# EAGLE design ParaBeep V0.2 (EAGLE 9.5.2)
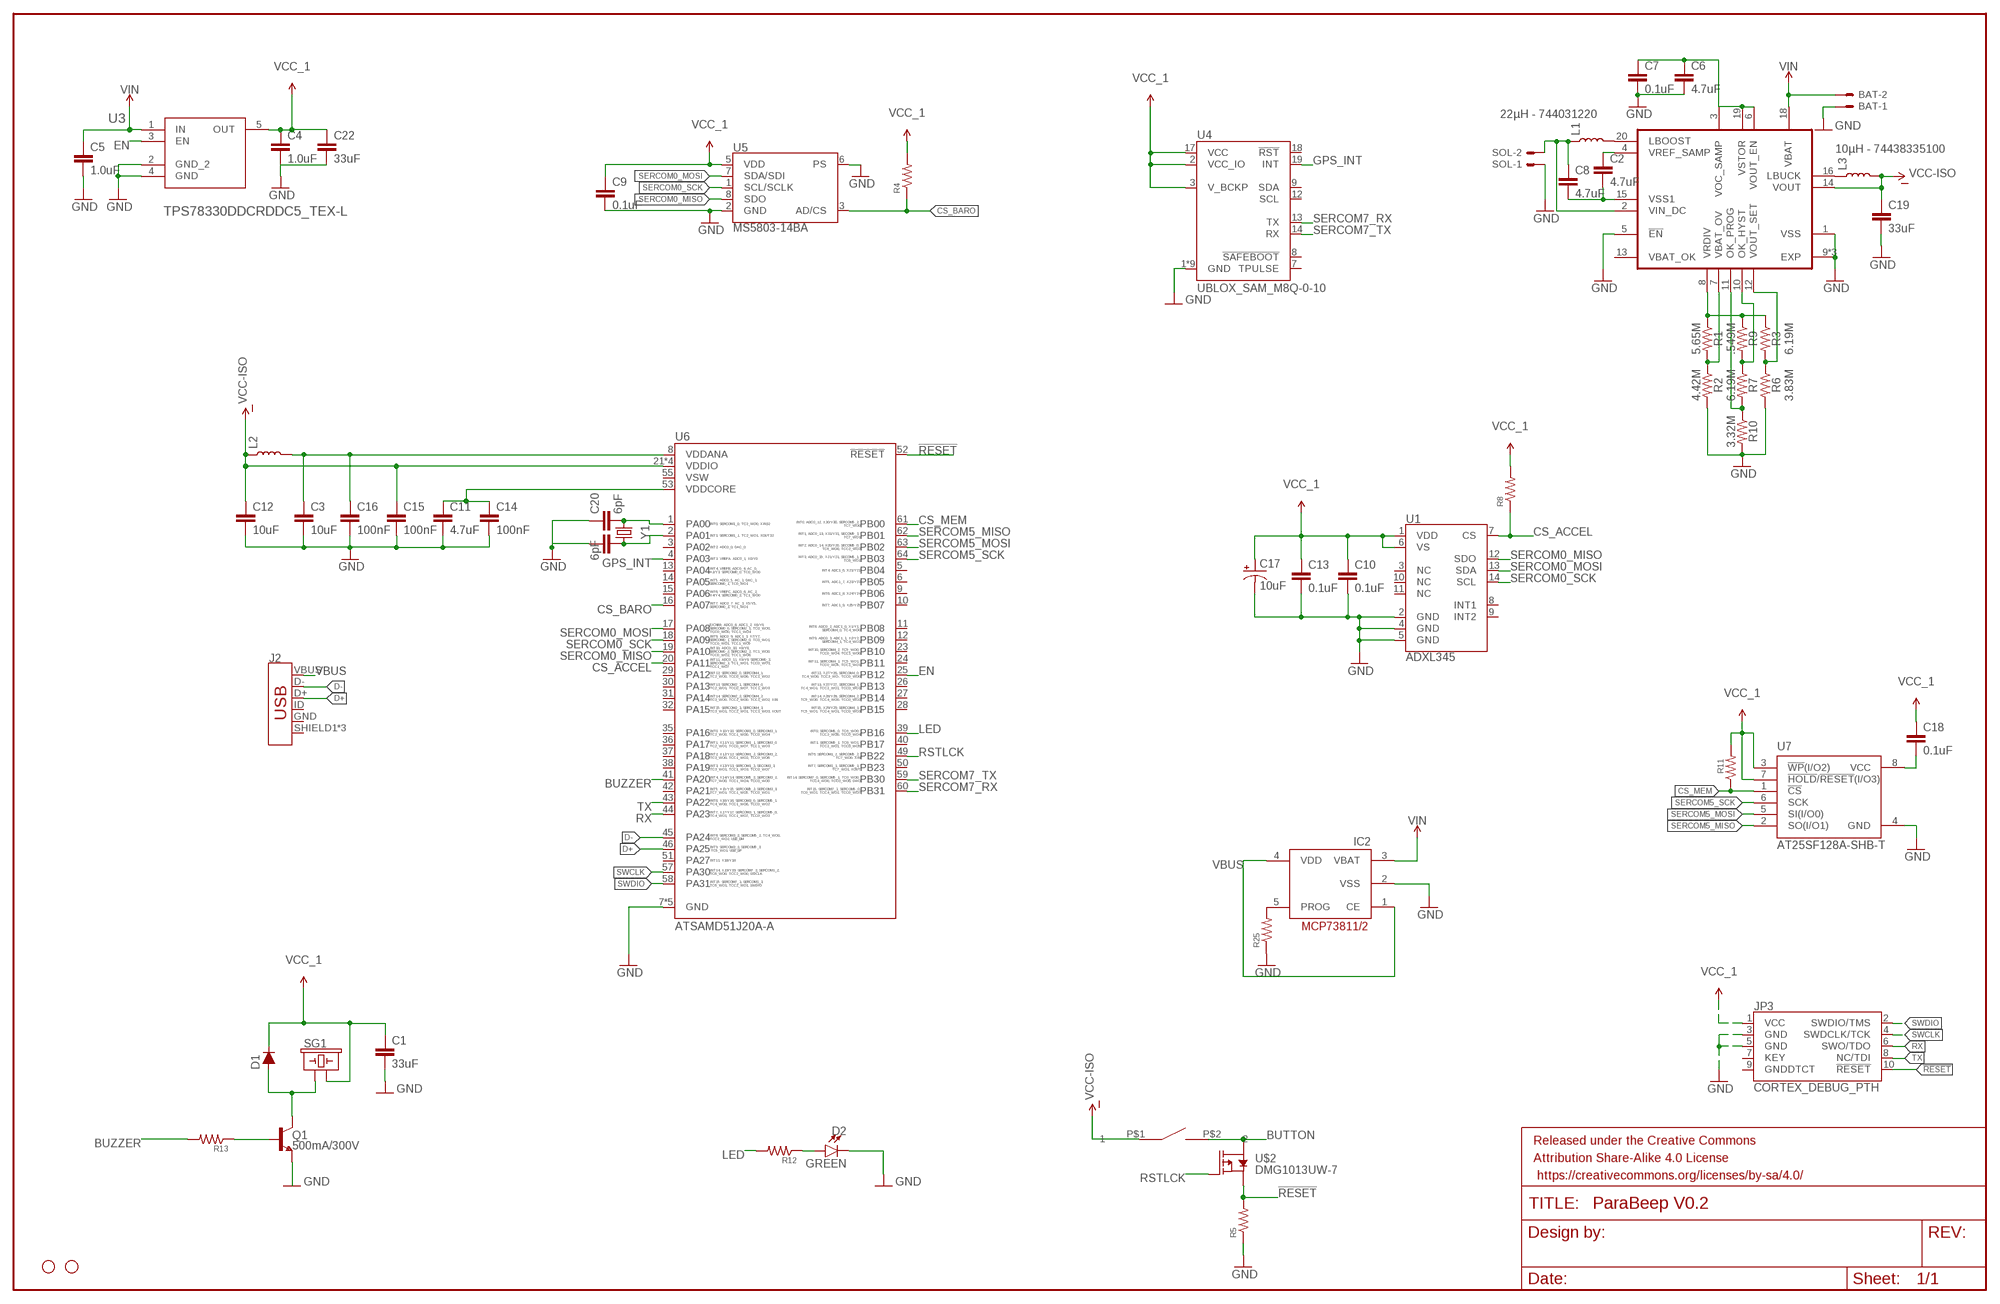
[diagram p0: schematic, sheet 1]

## Parts
BAT  SM02B-SSR-H-TB  [SM02B-SSR-H-TB]
C1  33uF  CAP-1206  [1206]
C2  4.7uF  4.7UF-0603-6.3V-(10%)  [0603]
C3  10uF  1.0UF-0603-16V-10%  [0603]
C4  1.0uF  1.0UF-0603-16V-10%  [0603]
C5  1.0uF  1.0UF-0603-16V-10%  [0603]
C6  4.7uF  4.7UF-0603-6.3V-(10%)  [0603]
C7  0.1uF  0.1UF-0603-25V-5%  [0603]
C8  4.7uF  4.7UF-0603-6.3V-(10%)  [0603]
C9  0.1uF  0.1UF-0603-25V-(+80/-20%)  [0603]
C10  0.1uF  0.1UF-0603-25V-(+80/-20%)  [0603]
C11  4.7uF  0.1UF-0603-25V-(+80/-20%)  [0603]
C12  10uF  0.1UF-0603-25V-(+80/-20%)  [0603]
C13  0.1uF  0.1UF-0603-25V-(+80/-20%)  [0603]
C14  100nF  0.1UF-0603-25V-(+80/-20%)  [0603]
C15  100nF  0.1UF-0603-25V-(+80/-20%)  [0603]
C16  100nF  0.1UF-0603-25V-(+80/-20%)  [0603]
C17  10uF  10UF-POLAR-0603-6.3V-20%(TANT)  [0603-POLAR]
C18  0.1uF  0.1UF-0603-25V-(+80/-20%)  [0603]
C19  33uF  CAP-1206  [1206]
C20  6pF  6PF-0402-50V-0.5%  [0402]
C21  6pF  6PF-0402-50V-0.5%  [0402]
C22  33uF  CAP-1206  [1206]
D1  250mA/100V  DIODE-BAS16J  [SOD-323]
D2  GREEN  LED-GREEN0603  [LED-0603]
FRAME1  FRAME-LEDGER  [CREATIVE_COMMONS]
H1  STAND-OFFTIGHT  [STAND-OFF-TIGHT]
H2  STAND-OFFTIGHT  [STAND-OFF-TIGHT]
IC2  MCP73811/2  [SOT23-5L]
J2  USB_MICRO-B_FEMALE-SMT  [USB-B-MICRO-SMD]
JP3  CORTEX_DEBUG_PTH  [2X5-PTH-1.27MM]
L1  22µH - 744031220  INDUCTOR-CDRH-4.7UH  [INDUCTOR_4.7UH]
L2  INDUCTORFB-30OHM  [0603]
L3  10µH - 74438335100  INDUCTOR-CDRH-4.7UH  [INDUCTOR_4.7UH]
Q1  500mA/300V  TRANS_NPN-MMBTA42  [SOT23-3]
R1  5.65M  RESISTOR0603  [0603]
R2  4.42M  RESISTOR0603  [0603]
R3  6.19M  RESISTOR0603  [0603]
R4  RESISTOR0402  [0402]
R5  RESISTOR0402  [0402]
R6  3.83M  RESISTOR0603  [0603]
R7  6.19M  RESISTOR0603  [0603]
R8  RESISTOR0402  [0402]
R9  .549M  RESISTOR0603  [0603]
R10  3.32M  RESISTOR0603  [0603]
R11  RESISTOR0402  [0402]
R12  RESISTOR0402  [0402]
R13  RESISTOR0402  [0402]
R25  RESISTOR0402  [0402]
SG1  BUZZER-SMD_KIT  [BUZZER-CCV-KIT]
SOL  SM02B-SSR-H-TB  [SM02B-SSR-H-TB]
U1  ADXL345  [LGA-14]
U2  BQ25570RGRR  [QFN50P350X350X100-21N]
U3  TPS78330DDCRDDC5_TEX-L  [DDC5_TEX-L]
U4  UBLOX_SAM_M8Q-0-10  [SAM-M8Q]
U5  MS5803-14BA  [MS5803]
U6  ATSAMD51J20A-A  [TQFP64]
U7  AT25SF128A-SHB-T  [SOIC127P790X216-8N]
U$2  DMG1013UW-7  [DMG1013UW-7]
U$3  AB11AH-HC  [AB11AH-HC]
Y1  32.768kHz  CRYSTAL-32.768KHZSMD-3.2X1.5  [CRYSTAL-SMD-3.2X1.5MM]

## Nets
!RESET: JP3.10(!RESET) R5.2 U6.52(!RESET) U$2.3(D)
BUTTON: U$2.2(S) U$3.P$2
BUZZER: R13.2 U6.41(PA20)
CS_ACCEL: R8.1 U1.7(CS) U6.20(PA11)
CS_BARO: R4.1 U5.3(AD/CS) U6.16(PA07)
CS_MEM: R11.1 U6.61(PB00) U7.1(!CS)
D+: J2.D+ U6.46(PA25)
D-: J2.D- U6.45(PA24)
EN: U3.3(EN) U6.25(PB12)
GND: BAT.1 C1.2 C3.2 C4.2 C5.2 C6.2 C7.2 C9.2 C10.2 C11.2 C12.2 C13.2 C14.2 C15.2 C16.2 C17.- C19.2 C20.1 C21.1 C22.2 D2.C IC2.2(VSS) JP3.3(GND) JP3.5(GND) Q1.2(E) R2.2 R5.1 R6.2 R10.2 R25.1 SOL.1 U1.2(GND) U1.4(GND) U1.5(GND) U2.1(VSS) U2.5(!EN) U2.9(EXP) U2.17(EXP) U2.21(EXP) U3.2(GND_2) U3.4(GND) U4.1(GND) U4.4(GND) U4.5(GND) U4.6(GND) U4.10(GND) U4.11(GND) U4.15(GND) U4.16(GND) U4.20(GND) U5.2(GND) U5.6(PS) U6.7(GND) U6.22(GND) U6.33(GND) U6.47(GND) U6.54(GND) U7.4(GND)
GPS_INT: U4.19(INT) U6.4(PA03)
LED: R12.2 U6.39(PB16)
N$1: C20.2 U6.1(PA00) Y1.P$2
N$2: C21.2 U6.2(PA01) Y1.P$1
N$3: R1.1 R3.1 R9.1 U2.8(VRDIV)
N$4: C2.1 U2.4(VREF_SAMP)
N$5: R7.2 R10.1 U2.11(OK_PROG)
N$6: R3.2 R6.1 U2.12(VOUT_SET)
N$7: R7.1 R9.2 U2.10(OK_HYST)
N$8: R1.2 R2.1 U2.7(VBAT_OV)
N$9: C2.2 C8.2 U2.15(VSS1)
N$10: D1.A Q1.3(C) SG1.+
N$11: C8.1 L1.P$1 SOL.2 U2.2(VIN_DC)
N$12: L3.P$1 U2.16(LBUCK)
N$13: Q1.1(B) R13.1
N$14: C18.2 U7.8(VCC)
N$15: L1.P$2 U2.20(LBOOST)
N$16: C6.1 C7.1 U2.3(VOC_SAMP) U2.6(VOUT_EN) U2.19(VSTOR)
N$17: D2.A R12.1
N$18: IC2.5(PROG) R25.2
N$19: C11.1 C14.1 U6.53(VDDCORE)
N$23: C3.1 C16.1 L2.2 U6.8(VDDANA)
RSTLCK: U6.49(PB22) U$2.1(G)
RX: JP3.6(SWO/TDO) U6.44(PA23)
SERCOM0_MISO: U1.12(SDO) U5.8(SDO) U6.19(PA10)
SERCOM0_MOSI: U1.13(SDA) U5.7(SDA/SDI) U6.17(PA08)
SERCOM0_SCK: U1.14(SCL) U5.1(SCL/SCLK) U6.18(PA09)
SERCOM5_MISO: U6.62(PB01) U7.2(SO(I/O1))
SERCOM5_MOSI: U6.63(PB02) U7.5(SI(I/O0))
SERCOM5_SCK: U6.64(PB03) U7.6(SCK)
SERCOM7_RX: U4.13(TX) U6.60(PB31)
SERCOM7_TX: U4.14(RX) U6.59(PB30)
SWCLK: JP3.4(SWDCLK/TCK) U6.57(PA30)
SWDIO: JP3.2(SWDIO/TMS) U6.58(PA31)
TX: JP3.8(NC/TDI) U6.43(PA22)
VBUS: IC2.1(CE) IC2.4(VDD) J2.VBUS
VCC-ISO: C12.1 C15.1 C19.1 L2.1 L3.P$2 U2.14(VOUT) U6.21(VDDIO) U6.34(VDDIO) U6.48(VDDIO) U6.56(VDDIO) U$3.P$1
VCC_1: C1.1 C4.1 C9.1 C10.1 C13.1 C17.+ C18.1 C22.1 D1.C JP3.1(VCC) R4.2 R8.2 R11.2 SG1.- U1.1(VDD) U1.6(VS) U3.5(OUT) U4.2(VCC_IO) U4.3(V_BCKP) U4.17(VCC) U5.5(VDD) U7.3(!WP!(I/O2)) U7.7(!HOLD!/!RESET!(I/O3))
VIN: BAT.2 C5.1 IC2.3(VBAT) U2.18(VBAT) U3.1(IN)
Unconnected: J2.ID J2.SHIELD1(SHIELD) J2.SHIELD2(SHIELD) J2.SHIELD3(SHIELD) JP3.7(KEY) JP3.9(GNDDTCT) U1.3(NC) U1.8(INT1) U1.9(INT2) U1.10(NC) U1.11(NC) U2.13(VBAT_OK) U4.7(TPULSE) U4.8(!SAFEBOOT) U4.9(SDA) U4.12(SCL) U4.18(!RST) U6.3(PA02) U6.5(PB04) U6.6(PB05) U6.9(PB06) U6.10(PB07) U6.11(PB08) U6.12(PB09) U6.13(PA04) U6.14(PA05) U6.15(PA06) U6.23(PB10) U6.24(PB11) U6.26(PB13) U6.27(PB14) U6.28(PB15) U6.29(PA12) U6.30(PA13) U6.31(PA14) U6.32(PA15) U6.35(PA16) U6.36(PA17) U6.37(PA18) U6.38(PA19) U6.40(PB17) U6.42(PA21) U6.50(PB23) U6.51(PA27) U6.55(VSW)

## Power pins joined to a net without a drawn wire
GND: J2.GND

## Library data of the parts
BAT SOL = con-jst2:SM02B-SSR-H-TB: Disconnectable Insulation displacement connector, 1.0mm pitch 2 contacts
C1 C19 C22 = SparkFun-Capacitors:CAP
C2 C6 C8 = SparkFun-Capacitors:4.7UF: 4.7µF ceramic capacitors A capacitor is a passive two-terminal electrical component used to store electrical energy temporarily in an electric field.; PROD_ID: CAP-08280
C3 = SparkFun-Capacitors:1.0UF: 1µF ceramic capacitors A capacitor is a passive two-terminal electrical component used to store electrical energy temporarily in an electric field.; PROD_ID: CAP-00868; VALUE: 1.0uF
C4 C5 = SparkFun-Capacitors:1.0UF: 1µF ceramic capacitors A capacitor is a passive two-terminal electrical component used to store electrical energy temporarily in an electric field.; PROD_ID: CAP-00868
C7 = SparkFun-Capacitors:0.1UF: 0.1µF ceramic capacitors A capacitor is a passive two-terminal electrical component used to store electrical energy temporarily in an electric field.; PROD_ID: CAP-08604
C9 C10 C13 C18 = SparkFun-Capacitors:0.1UF: 0.1µF ceramic capacitors A capacitor is a passive two-terminal electrical component used to store electrical energy temporarily in an electric field.; PROD_ID: CAP-00810
C11 C12 C14-C16 = SparkFun-Capacitors:0.1UF: 0.1µF ceramic capacitors A capacitor is a passive two-terminal electrical component used to store electrical energy temporarily in an electric field.; PROD_ID: CAP-00810; VALUE: 0.1uF
C17 = SparkFun-Capacitors:10UF-POLAR: 10.0µF polarized capacitors A capacitor is a passive two-terminal electrical component used to store electrical energy temporarily in an electric field.; PROD_ID: CAP-13210
C20 C21 = SparkFun-Capacitors:6PF: 6pF ceramic capacitors A capacitor is a passive two-terminal electrical component used to store electrical energy temporarily in an electric field.; PROD_ID: CAP-13455
D1 = SparkFun-DiscreteSemi:DIODE: Diode These are standard reverse protection diodes and small signal diodes. SparkFun Products: SparkFun SparkPunk Sound Kit <https://www.sparkfun.com/products/11177> SparkFun ESP8266 Thing <https://www.sparkfun.com/products/13231>; PROD_ID: DIO-09646
D2 = SparkFun-LED:LED-GREEN: Green SMD LED Used in manufacturing of various products at SparkFun Packages: 0603 - SMD 0603 package [Product Link] <http://www.futureelectronics.com/en/technologies/semiconductors/optoelectronics/leds/Pages/9894312-LTST-C190GKT.aspx?CrossPart=HSMG-C190&IM=0> LilyPad 1206 - SMD1206 LilyPad package [Product Link] <http://www.futureelectronics.com/en/Technologies/Product.aspx?ProductID=IN150NGHARVATEKCORPORATION2049943&IM=0> 1206 - SMD1206 package [Product Link] <http://www.futureelectronics.com/en/technologies/semiconductors/optoelectronics/leds/Pages/8315665-LTST-C150KGKT.aspx?IM=0> 1206 Bottom Mount -SMD 1206 Bottom Mount [Product Link] <http://www.digikey.com/product-detail/en/lite-on-inc/LTST-C230KGKT/160-1456-1-ND/386854> SparkFun Products: Pro Mini 328 -5V <https://www.sparkfun.com/products/821> RedBoard <https://www.sparkfun.com/products/12757> MP3 Trigger <https://www.sparkfun.com/products/13720> Makey Makey <https://www.sparkfun.com/products/11076>; PROD_ID: DIO-00821
FRAME1 = SparkFun-Aesthetics:FRAME-LEDGER: Schematic Frame - Ledger Standard 11x14 US Ledger frame
H1 H2 = SparkFun-Hardware:STAND-OFF: Stand Off Drill holes for mechanically mounting via screws, standoffs, etc. Note: Use the keepout ring to avoid running the screw head into surrounding components. Variant Overviews STAND-OFF - Mechanical footprint for a #4 phillips button head screw. STAND-OFF-TIGHT - Mechanical footprint for a #4 phillips button head screw, Example SparkFun Products Screw - Phillips Head (1/4", 4-40, 10 pack) <https://www.sparkfun.com/products/10453> (PRT-10453) Screw - Phillips Head (1/2", 4-40, 10 pack) <https://www.sparkfun.com/products/10452> (PRT-10452) Screw - Phillips Head (3/4", 4-40, 10 pack) <https://www.sparkfun.com/products/10451> (PRT-10451) Screw - Phillips Head (1", 4-40, 10 pack) <https://www.sparkfun.com/products/10450> (PRT-10450)
IC2 = adafruit:MCP73811/2: MCP73811 and MCP73812 Simple, Miniature Single-Cell, Fully Integrated Li-Ion / Li-Polymer Charge Management Controllers SOT-23-5 package, no indicator LED but with adjustable current, small and very inexpensive
J2 = SparkFun-Connectors:USB_MICRO-B: USB Type Micro-B Connector Male/female and PTH/SMT variants SparkFun Products: SparkFun microB USB Breakout <https://www.sparkfun.com/products/12035> SparkFun USB microB Plug Breakout <https://www.sparkfun.com/products/10031> SparkFun ESP8266 Thing <https://www.sparkfun.com/products/13231>; PROD_ID: CONN-11752
JP3 = SparkFun-Connectors:CORTEX_DEBUG: Cortex Debug Connector - 10 pin Supports JTAG debug, Serial Wire debug, and Serial Wire Viewer. PTH and SMD connector options available. General Connector Information <http://infocenter.arm.com/help/topic/com.arm.doc.faqs/attached/13634/cortex_debug_connectors.pdf> Products: PTH Connector <http://www.digikey.com/product-detail/en/cnc-tech/3220-10-0100-00/1175-1627-ND/3883661> -via Digi-Key SparkFun PSoc <https://www.sparkfun.com/products/13229> SparkFun T <https://www.sparkfun.com/products/13810>
L1 L3 = SparkFun-Coils:INDUCTOR: Inductors Resist changes in electrical current. Basically a coil of wire. SparkFun Products: SparkFun Load Cell Amplifier - HX711 <https://www.sparkfun.com/products/13879> IOIO-OTG - V2.2 <https://www.sparkfun.com/products/13613>; PROD_ID: NDUC-10146; VALUE: 4.7µH/±30%/1.2A
L2 = SparkFun-Coils:INDUCTOR: Inductors Resist changes in electrical current. Basically a coil of wire. SparkFun Products: SparkFun Load Cell Amplifier - HX711 <https://www.sparkfun.com/products/13879> IOIO-OTG - V2.2 <https://www.sparkfun.com/products/13613>; PROD_ID: NDUC-07859
Q1 = SparkFun-DiscreteSemi:TRANS_NPN: NPN transistor Current controlled devices typically used to amplify current or used as a switch. BC547 - COM-08928 <http://www.sparkfun.com/products/8928> (TO-92 45V 100mA) (1.Collector 2.Base 3.Emitter) 2N3904 - COM-00521 <http://www.sparkfun.com/products/521> (TO-92 40V 200mA) (1.Emitter 2.Base 3.Collector) P2N2222A - COM-12852 <http://www.sparkfun.com/products/12852> (TO-92 40V 600mA) (1.Collector 2.Base 3.Emitter); PROD_ID: TRANS-09116
R1-R13 R25 = SparkFun-Resistors:RESISTOR: Generic Resistor Package
SG1 = SparkFun-Electromechanical:BUZZER: Buzzer Small round buzzers that operate around the audible 2kHz range. You can use these as speakers to create simple music or user interfaces. Variant Overview: PTH - Mini Speaker - PC Mount 12mm 2.048kHz <https://www.sparkfun.com/products/7950> PTH_KIT - Mini Speaker - PC Mount 12mm 2.048kHz <https://www.sparkfun.com/products/7950> KIT simplifies soldering by adding stop mask to one side of the pads. PTH_NO_SILK - Mini Speaker - PC Mount 12mm 2.048kHz <https://www.sparkfun.com/products/7950> No silkscreen indicator of buzzer outline. PTH_KIT_NO_SILK - Mini Speaker - PC Mount 12mm 2.048kHz <https://www.sparkfun.com/products/7950> KIT package w/o silkscreen SMD - Buzzer Audio Magnetic (CCV-084B16) SMD buzzer used on, e.g. the LilyPad Buzzer <https://www.sparkfun.com/products/8463> and RFID USB Reader <https://www.sparkfun.com/products/9963>. SMD_KIT - Buzzer Audio Magnetic (CCV-084B16) SMD Buzzer with elongated pins to make soldering easier. Used on the SparkFun Simon Says - Surface Mount Soldering Kit <https://www.sparkfun.com/products/10935>.; PROD_ID: COMP-08568
U1 = SparkFun-Sensors:ADXL345: Analog Devices ADXL345 3-Axis SPI/I2C 2/4/8/16g Accelerometer The ADXL345 is a small, thin, low power, 3-axis accelerometer with high resolution (13-bit) measurement at up to ±16g. Digital output data is formatted as 16-bit twos complement and is accessible through either a SPI (3- or 4-wire) or I2C digital interface. Datasheet <https://www.sparkfun.com/datasheets/Sensors/Accelerometer/ADXL345.pdf> SparkFun Products SparkFun Triple Axis Accelerometer Breakout - ADXL345 <https://www.sparkfun.com/products/9836> (SEN-09836) Triple Axis Accelerometer - ADXL345 <https://www.sparkfun.com/products/9045> (SEN-09045) SparkFun 6 Degrees of Freedom IMU Digital Combo Board - ITG3200/ADXL345 <https://www.sparkfun.com/products/10121> (SEN-10121); PROD_ID: IC-09097; SF_ID: SEN-09045
U2 = BQ25570RGRR:BQ25570RGRR; DESCRIPTION: Ultra Low power Harvester power Management IC with boost charger, and Nanopower Buck Converter 20-VQFN -40 to 125; DIGI-KEY_PART_NUMBER: 296-39934-1-ND; MF: Texas Instruments; MP: BQ25570RGRR; PACKAGE: VQFN-20 Texas Instruments; PURCHASE-URL: https://pricing.snapeda.com/search/part/BQ25570RGRR/?ref=eda
U3 = TPS78330DDCR:TPS78330DDCR; BUILT_BY: EMA_UL_Team; MANUFACTURER: Texas Instruments; MANUFACTURER_PART_NUMBER: TPS78330DDCR; SOURCELIBRARY: TI_2014-06-19; VENDOR: Texas Instruments
U4 = SparkFun-GPS:UBLOX_SAM_M8Q-0-10: u-blox SAM-M8Q The u-blox concurrent SAM-M8Q GNSS patch antenna module benefits from the exceptional performance of the u-blox M8 multi-GNSS engine. The SAM-M8Q module offers high sensitivity and minimal acquisition times in an ultra compact form factor. The SAM-M8Q module utilizes concurrent reception of up to three GNSS systems (GPS/Galileo and GLONASS), recognizes multiple constellations simultaneously and provides outstanding positioning accuracy in scenarios where urban canyon or weak signals are involved. For even better and faster positioning improvement, the SAM-M8Q supports augmentation of QZSS, GAGAN and IMES together with WAAS, EGNOS, MSAS. The SAM-M8Q also supports message integrity protection, geofencing, and spoofing detection with configurable interface settings to easily fit to customer applications.; PROD_ID: IC-14070
U5 = SparkFun-Sensors:MS5803-14BA: Measurement Specialties MS5803_14BA Pressure (Depth) Sensor The MS5803-14BA is a new generation of high resolution pressure sensors with SPI and I2C bus interface. It is optimized for depth measurement systems with a water depth resolution of 1cm and below. The sensor module includes a high linear pressure sensor and an ultra low power 24 bit ΔΣ ADC with internal factory calibrated coefficients. It provides a precise digital 24 Bit pressure and temperature value and different operation modes that allow the user to optimize for conversion speed and current consumption. Datasheet <https://cdn.sparkfun.com/datasheets/Sensors/Weather/ms5803_14ba.pdf> SparkFun Products SparkFun Pressure Sensor Breakout - MS5803-14BA <https://www.sparkfun.com/products/12909> (SEN-12909); PROD_ID: IC-12111
U6 = SparkFun-IC-Microcontroller:ATSAMD51J20A-A; PROD_ID: IC-13952
U7 = AT25SF128A-SHB-T:AT25SF128A-SHB-T: 4Mbit, 1.65V - 3.6V Range, SPI Serial Flash Memory with Multy-I/O Support.; DESCRIPTION: 128 Mbit, 3.0V (2.7V to 3.6V), -40C to 85C, SOIC-W 208mil (Tape & Reel), Single, Dual, Quad SPI NOR flash; MF: Dialog Semiconductor; MP: AT25SF128A-SHB-T; PACKAGE: SOIC-8 Dialog Semiconductor; PURCHASE-URL: https://pricing.snapeda.com/search/part/AT25SF128A-SHB-T/?ref=eda
U$2 = DMG1013UW-7:DMG1013UW-7
U$3 = AB11AH-HC:AB11AH-HC
Y1 = SparkFun-Clocks:CRYSTAL-32.768KHZ: 32.768kHz Crystal Frequency: 32.768kHz Frequency Stability: ±20ppm Load Capacitance: 12.5pF (PTH-2X6 & SMD-3.2X1.5), 6pF (SMD-2X6) SparkFun Products: SparkFun BigTime Watch Kit <https://www.sparkfun.com/products/11734> SparkFun nRF52832 Breakout <https://www.sparkfun.com/products/13990> SparkFun Real Time Clock Module <https://www.sparkfun.com/products/12708>; PROD_ID: XTAL-13062

## Board
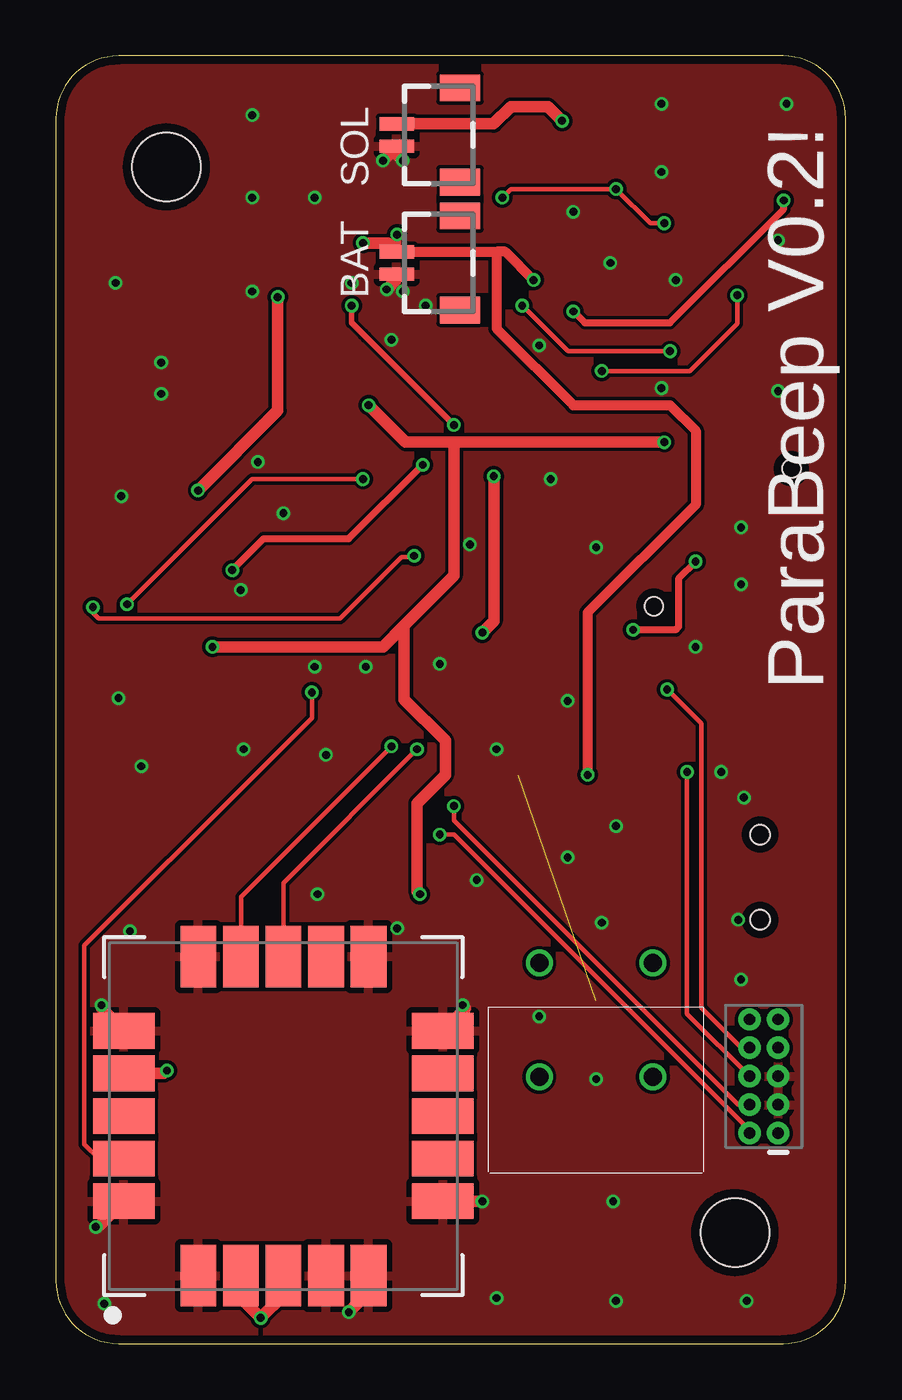
[diagram p1: board, top side]
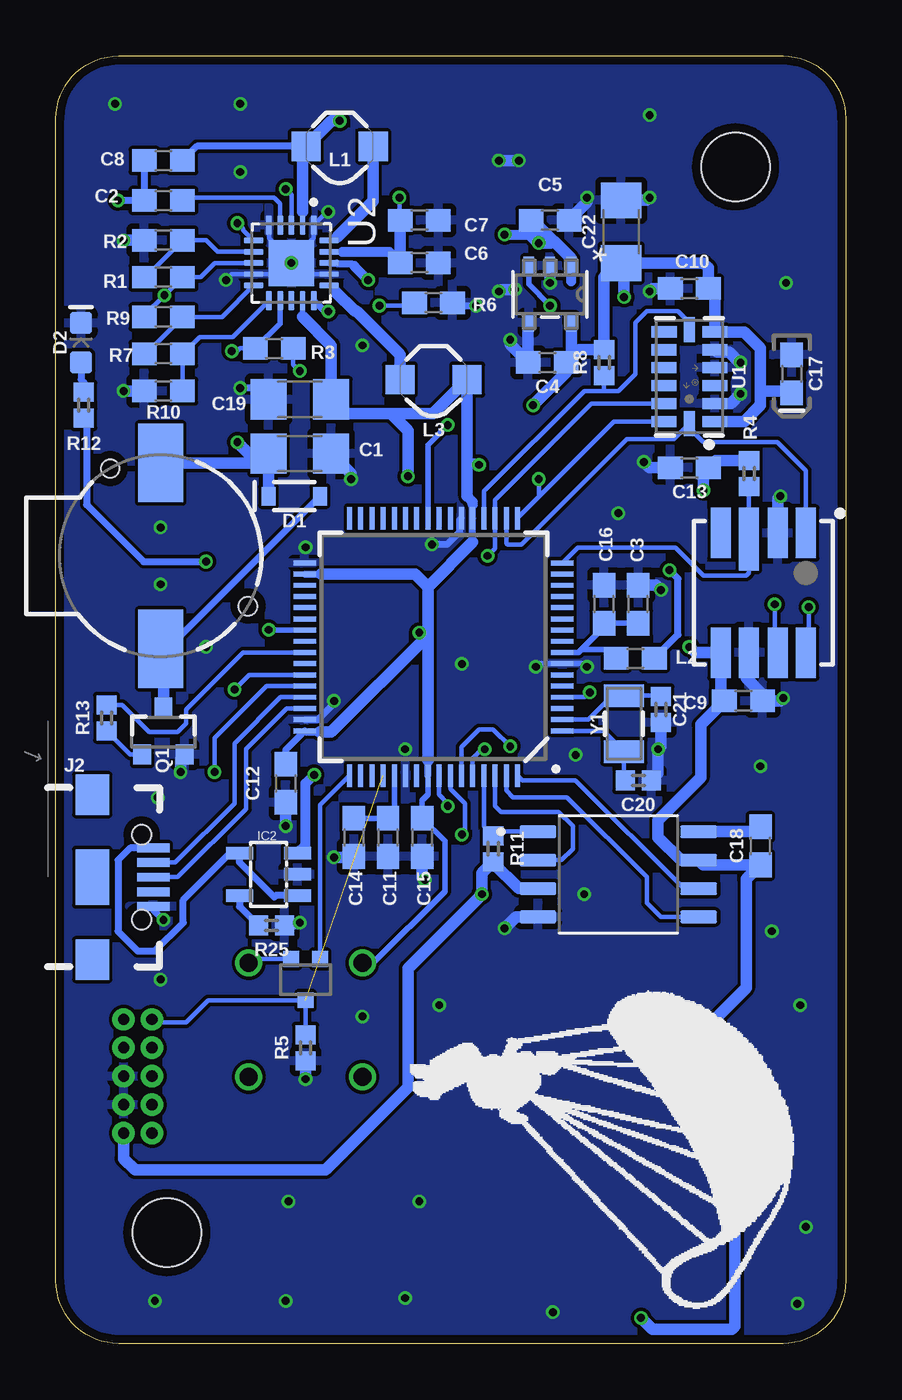
[diagram p2: board, bottom side, seen from below]

Size 35.28 x 57.51 mm. Coordinates in mm from the lower left corner, seen from the top.
Outline: 0,54.71 0,2.79 arc90 2.79,0 32.49,0 arc90 35.28,2.79 35.28,54.71 arc90 32.49,57.51 2.79,57.51 arc90 0,54.71
Copper layers (1*16): Top 0.035559375mm / dielectric 1.6mm / Bottom 0.035559375mm
Design rules "oshpark-2layer *": minimum track width 6mil, minimum drill 10mil, track to track 6mil, track to pad 6mil, pad to pad 6mil, via to via 6mil, smd to smd 6mil, copper to edge 15mil, drill to drill 6mil, minimum pad ring 5mil, minimum via ring 5mil, stop-mask expansion 2.5mil, vias tented up to drill 30mil, thermal gap 10mil

### Footprints (pad centres in the part's own frame; a part is rotated, then mirrored left to right if it is on the bottom)
SM02B-SSR-H-TB = smd 0.6 x 1.55: 1 -0.5,1.925; 2 0.5,1.925 | smd 1.2 x 1.8: FIT@1 -2.1,-0.9; FIT@2 2.1,-0.9
1206 = smd 1.6 x 1.8: 1 -1.4,0; 2 1.4,0
0603 = smd 1.1 x 1: 1 -0.85,0; 2 0.85,0
0603-POLAR = smd 1.1 x 1: + 0.85,0; - -0.85,0
0402 = smd 0.85 x 0.9: 1 -0.58,0; 2 0.58,0
SOD-323 = smd 0.63 x 0.83: A 1.15,0; C -1.15,0
LED-0603 = smd 1 x 1: A -0.877,0; C 0.877,0
STAND-OFF-TIGHT = hole 3.048: 0,0
SOT23-5L = smd 0.55 x 1.2: 1 -0.95,-1.3; 2 0,-1.3; 3 0.95,-1.3; 4 0.95,1.3; 5 -0.95,1.3
USB-B-MICRO-SMD = smd 1.45 x 0.4: D+ 2.725,0; D- 2.725,0.65; GND 2.725,-1.3; ID 2.725,-0.65; VBUS 2.725,1.3 | smd 1.5 x 1.8: SHIELD1 0,3.685; SHIELD2 0,-3.685 | smd 1.5 x 2.5: SHIELD3 0,0 | hole 0.85: 2.2,1.9; 2.2,-1.9
2X5-PTH-1.27MM = drill 0.508 pad 1: 1 -2.54,-0.635; 2 -2.54,0.635; 3 -1.27,-0.635; 4 -1.27,0.635; 5 0,-0.635; 6 0,0.635; 7 1.27,-0.635; 8 1.27,0.635; 9 2.54,-0.635; 10 2.54,0.635
INDUCTOR_4.7UH = smd 1.3 x 1.3: P$1 -1.5,0; P$2 1.5,0
SOT23-3 = smd 0.8 x 0.9: 1 -0.95,-1; 2 0.95,-1; 3 0,1.1
BUZZER-CCV-KIT = smd 3.5 x 2: + 4.15,0; - -4.15,0 | hole 0.8: -3.9,-2.25; 2.25,3.9
LGA-14 = smd 0.5 x 1.124: 1 2,1.138; 2 1.2,1.138; 3 0.4,1.138; 4 -0.4,1.138; 5 -1.2,1.138; 6 -2,1.138; 8 -2,-1.13; 9 -1.2,-1.138; 10 -0.4,-1.138; 11 0.4,-1.138; 12 1.2,-1.138; 13 2,-1.138 | smd 1.124 x 0.5: 7 -2.1,0; 14 2.1,0
QFN50P350X350X100-21N = smd 0.88 x 0.26: 1 -1.685,1; 2 -1.685,0.5; 3 -1.685,0; 4 -1.685,-0.5; 5 -1.685,-1; 11 1.685,-1; 12 1.685,-0.5; 13 1.685,0; 14 1.685,0.5; 15 1.685,1 | smd 0.26 x 0.88: 6 -1,-1.685; 7 -0.5,-1.685; 8 0,-1.685; 9 0.5,-1.685; 10 1,-1.685; 16 1,1.685; 17 0.5,1.685; 18 0,1.685; 19 -0.5,1.685; 20 -1,1.685 | smd 2.05 x 2.05: 21 0,0
DDC5_TEX-L = smd 0.8 x 0.457: 1 -1.276,0.95; 2 -1.276,0; 3 -1.276,-0.95; 4 1.276,-0.95; 5 1.276,0.95
SAM-M8Q = smd 2.75 x 1.6: 1 -7.125,3.8; 2 -7.125,1.9; 3 -7.125,0; 4 -7.125,-1.9; 5 -7.125,-3.8; 11 7.125,-3.8; 12 7.125,-1.9; 13 7.125,0; 14 7.125,1.9; 15 7.125,3.8 | smd 1.6 x 2.75: 6 -3.8,-7.125; 7 -1.9,-7.125; 8 0,-7.125; 9 1.9,-7.125; 10 3.8,-7.125; 16 3.8,7.125; 17 1.9,7.125; 18 0,7.125; 19 -1.9,7.125; 20 -3.8,7.125
MS5803 = smd 2.25 x 0.9: 1 -2.675,1.9; 2 -2.675,0.65; 4 -2.675,-1.9; 5 2.675,-1.9; 6 2.675,-0.65; 7 2.675,0.65; 8 2.675,1.9 | smd 2.8 x 0.9: 3 -2.4,-0.65
TQFP64 = smd 0.22 x 1: 1 -3.75,-5.75; 2 -3.25,-5.75; 3 -2.75,-5.75; 4 -2.25,-5.75; 5 -1.75,-5.75; 6 -1.25,-5.75; 7 -0.75,-5.75; 8 -0.25,-5.75; 9 0.25,-5.75; 10 0.75,-5.75; 11 1.25,-5.75; 12 1.75,-5.75; 13 2.25,-5.75; 14 2.75,-5.75; 15 3.25,-5.75; 16 3.75,-5.75; 33 3.75,5.75; 34 3.25,5.75; 35 2.75,5.75; 36 2.25,5.75; 37 1.75,5.75; 38 1.25,5.75; 39 0.75,5.75; 40 0.25,5.75; 41 -0.25,5.75; 42 -0.75,5.75; 43 -1.25,5.75; 44 -1.75,5.75; 45 -2.25,5.75; 46 -2.75,5.75; 47 -3.25,5.75; 48 -3.75,5.75 | smd 1 x 0.22: 17 5.75,-3.75; 18 5.75,-3.25; 19 5.75,-2.75; 20 5.75,-2.25; 21 5.75,-1.75; 22 5.75,-1.25; 23 5.75,-0.75; 24 5.75,-0.25; 25 5.75,0.25; 26 5.75,0.75; 27 5.75,1.25; 28 5.75,1.75; 29 5.75,2.25; 30 5.75,2.75; 31 5.75,3.25; 32 5.75,3.75; 49 -5.75,3.75; 50 -5.75,3.25; 51 -5.75,2.75; 52 -5.75,2.25; 53 -5.75,1.75; 54 -5.75,1.25; 55 -5.75,0.75; 56 -5.75,0.25; 57 -5.75,-0.25; 58 -5.75,-0.75; 59 -5.75,-1.25; 60 -5.75,-1.75; 61 -5.75,-2.25; 62 -5.75,-2.75; 63 -5.75,-3.25; 64 -5.75,-3.75
SOIC127P790X216-8N = smd 1.65 x 0.58: 1 -3.585,1.905; 2 -3.585,0.635; 3 -3.585,-0.635; 4 -3.585,-1.905; 5 3.585,-1.905; 6 3.585,-0.635; 7 3.585,0.635; 8 3.585,1.905
DMG1013UW-7 = smd 0.7 x 0.7: 1 -0.65,-0.925; 2 0.65,-0.925; 3 0,0.925
AB11AH-HC = drill 0.8: P$1 -2.54,9.373; P$2 2.54,9.373; P$3 -2.54,4.293; P$4 2.54,4.293
CRYSTAL-SMD-3.2X1.5MM = smd 1 x 1.8: P$1 -1.25,0; P$2 1.25,0

### Placement (x,y rotation side)
BAT  17.14,48.26 90 top
C1  24.38,39.75 0 bottom
C2  30.48,51.05 180 bottom
C3  9.27,33.02 90 bottom
C4  13.34,43.81 180 bottom
C5  13.21,50.16 0 bottom
C6  19.05,48.26 0 bottom
C7  19.05,50.16 0 bottom
C8  30.48,52.83 180 bottom
C9  4.57,28.7 0 bottom
C10  6.99,47.12 180 bottom
C11  20.45,22.61 270 bottom
C12  25.02,25.02 270 bottom
C13  6.99,39.12 180 bottom
C14  21.97,22.61 270 bottom
C15  18.92,22.61 270 bottom
C16  10.79,33.02 90 bottom
C17  2.41,43.31 270 bottom
C18  3.81,22.23 90 bottom
C19  24.38,42.16 180 bottom
C20  9.27,25.15 180 bottom
C21  8.26,28.32 90 bottom
C22  10.03,49.66 90 bottom
D1  24.64,37.85 0 bottom
D2  34.16,44.7 90 bottom
FRAME1  15.88,-29.84 0 top  (outside the outline)
H1  4.93,52.55 0 top
H2  30.33,4.95 0 top
IC2  25.78,20.95 90 bottom
J2  33.66,20.83 0 bottom
JP3  31.62,11.94 90 top
L1  22.61,53.47 0 bottom
L2  9.4,30.61 180 bottom
L3  18.41,43.05 0 bottom
Q1  30.48,27.3 0 bottom
R1  30.48,47.62 180 bottom
R2  30.48,49.28 180 bottom
R3  25.53,44.45 180 bottom
R4  4.32,38.86 90 bottom
R5  24.13,13.21 90 bottom
R6  18.41,46.48 0 bottom
R7  30.48,44.2 0 bottom
R8  10.79,43.81 90 bottom
R9  30.48,45.85 0 bottom
R10  30.48,42.55 180 bottom
R11  15.75,22.1 270 bottom
R12  34.04,41.91 270 bottom
R13  33.02,27.94 90 bottom
R25  25.65,18.67 180 bottom
SG1  30.61,35.18 270 bottom
SOL  17.14,53.98 90 top
U1  6.99,43.18 270 bottom
U2  24.77,48.26 270 bottom
U3  13.21,46.86 270 bottom
U4  10.16,10.16 90 top
U5  3.68,33.53 270 bottom
U6  18.41,31.11 90 bottom
U7  10.16,20.95 0 bottom
U$2  24.13,16.26 180 bottom
U$3  24.13,7.62 0 top
U$5  [PARA]  19.68,17.14 270 bottom
Y1  9.91,27.69 270 bottom

### Tracks (layer width: path | path; a pad name or v marks a point on that pad's centre or on a via)
!RESET  (1 unrouted)
  Bottom 0.203: R5.2 U$2.3 28.48,15.33 29.46,14.35 30.86,14.35 JP3.10
BUTTON
  Bottom 0.203: U$2.2 26.48,17.18 U$3.P$2
BUZZER
  Bottom 0.203: U6.41 26.92,30.86 29.46,28.32 29.46,27.69 29.84,27.3 31.11,27.3 32.33,28.52 R13.2
CS_ACCEL
  Bottom 0.203: U6.20 16.16,38.06 11.68,42.55 10.79,42.55 | U1.7 6.99,45.59 7.49,46.1 8.89,46.1 9.4,45.59 9.4,43.31 10.16,42.55 10.79,42.55 | R8.1 10.79,42.55
CS_BARO
  Bottom 0.203: U6.16 11.97,35.56 7.62,35.56 6.35,34.29 4.45,34.29 4.33,34.4 U5.3 4.33,38.27 R4.1
CS_MEM
  Bottom 0.203: U6.61 16.16,23.09 R11.1 15.57,22.86 U7.1
D+
  Bottom 0.203: U6.46 24.98,28.36 26.8,26.54 26.8,23.88 29.84,20.83 J2.D+
D-
  Bottom 0.203: J2.D- 29.96,21.48 27.3,24.13 27.3,26.8 25.24,28.86 U6.45
EN  (via drill 0.35)
  Top 0.254: v17.78,41.02 13.84,44.96 13.72,45.09 13.21,45.59 v13.21,46.35
  Bottom 0.254: U6.25 18.66,40.14 v17.78,41.02 | U3.3 14.16,47.3 v13.21,46.35
GND  (via drill 0.35)
  Top 0.508: U4.10 18.3,14.97 v18.16,15.11 | U4.16 2.03,14.96 v2.03,15.11 | U4.6 v19.04,6.36 v19.05,6.35 | U4.5 13.96,2.28 v13.08,1.4 | U4.20 1.88,5.21 v1.78,5.21 | BAT.1 15.22,47.53 v14.77,47.08 | v14.61,52.83 15.22,53.45 SOL.1 15.22,53.11 v15.49,52.83
  Bottom 0.203: 24.77,48.39 U2.21 | 24.77,48.39 23.77,49.38 23.77,49.48 U2.1 23.16,50.55 v23.11,50.55 | U2.17 24.27,47.76 U2.21 | U2.5 25.77,49.48 25.76,49.48 25.76,49.38 24.77,48.39 | U2.21 25.27,47.76 U2.9 27.42,47.76 v27.69,47.5
  Bottom 0.254: v11.56,30.23 11.7,30.36 U6.7 13.7,30.36 v13.84,30.23
  Bottom 0.305: C19.2 26.29,42.67 v27.05,42.67 | R6.2 17.44,46.35 v16.51,46.35 | U6.22 17.25,36.78 17.25,36.24 17.8,35.69 v18.49,35.69 | R25.1 24.51,18.67 v24.38,18.8 | J2.GND 30.93,19.37 v30.48,18.92 | U6.47 23.57,27.86 22.86,28.57 v22.86,28.7
  Bottom 0.508: R10.2 v32.26,42.55 | R2.2 v32.26,49.28 | U3.4 14.19,45.56 C4.2 14.99,44.62 v14.99,44.83 | U3.2 v13.21,47.37 | C5.2 11.56,50.97 v11.56,51.18 | C10.2 8.64,47.12 v8.76,46.99 | C13.2 8.76,39.12 v9.02,39.37 | U5.2 3.03,37.73 v2.92,37.85 | U5.6 4.45,30.74 4.45,29.72 3.72,29 C9.2 2.92,28.7 v2.79,28.83 | C21.1 8.26,26.67 v8.38,26.54 8.38,25.45 C20.1 | U7.4 14.73,19.05 v15.24,18.54 | R5.1 v24.13,11.81 | C12.2 v25.02,23.11 | C14.2 22.01,21.72 v22.86,21.72 | C15.2 18.92,20.83 v18.8,20.7 | Q1.2 29.72,26.12 v29.72,25.53 | C1.2 22.1,38.87 v22.1,38.61 | v14.77,47.08 15.4,47.08 v15.49,46.99 | C22.2 8.89,51.06 v8.76,51.18 | U1.5 5.74,44.27 5.2,44.27 4.75,43.81 v4.7,43.81 | U1.2 5.14,41.98 v4.7,42.42 | C3.2 8.47,33.87 v8.26,33.66 | v14.61,52.83 v15.49,52.83
  other vias: 24.77,48.26 17.14,30.35 19.68,26.54 30.61,33.91 30.61,36.45 24.13,35.56 10.16,37.08 27.05,52.32 27.05,55.37 32.64,55.37 8.76,54.86 2.67,47.37 3.81,25.78 11.68,20.07 3.3,18.41 21.59,14.61 30.61,16.26 30.73,24.38 2.16,1.78 19.68,2.03 25.02,1.91 24.89,6.35 30.86,1.91 12.06,26.29 21.59,44.58 28.57,31.11
  pour Bottom: -5.08,-4.45 -5.08,60.33 38.1,60.33 38.1,-5.08 -4.45,-5.08
  pour Top: -5.08,-5.71 -5.08,60.96 -4.45,61.59 36.83,61.59 38.1,60.33 38.1,-5.08 37.47,-5.71
GPS_INT  (via drill 0.35)
  Top 0.203: v11.43,29.08 11.43,27.94 8.89,25.4 1.27,17.78 1.27,8.89 1.9,8.26 U4.19
  Bottom 0.203: U6.4 11.65,28.86 v11.43,29.08
LED  (via drill 0.35)
  Top 0.305: v28.57,34.92 27.81,34.16 27.81,32 27.69,31.88 v25.78,31.88
  Bottom 0.254: U6.39 25.77,31.86 v25.78,31.88
  Bottom 0.305: R12.2 33.91,41.2 33.91,37.47 31.37,34.92 v28.57,34.92
N$1
  Bottom 0.203: U6.1 10.84,27.36 Y1.P$2 9.91,25.2 C20.2
N$2
  Bottom 0.203: U6.2 11.51,27.86 10.43,28.94 Y1.P$1 8.29,28.94 C21.2
N$3  (via drill 0.35)
  Top 0.203: v24.38,43.43 28.32,43.43 30.44,45.55 v30.44,46.82
  Bottom 0.203: U2.8 28.19,48.26 28.83,47.62 R1.1 v30.44,46.82 31.33,45.92 R9.1 | R3.1 24.68,43.73 v24.38,43.43
N$4
  Bottom 0.203: U2.4 25.27,50.92 25.53,51.18 29.5,51.18 C2.1
N$5
  Bottom 0.203: U2.11 27.38,44.96 28.87,44.96 R7.2 R10.1
N$6  (via drill 0.35)
  Top 0.203: v27.43,44.32 22.86,44.32 v20.83,46.35
  Bottom 0.203: R3.2 27.05,44.45 27.3,44.2 v27.43,44.32 | v20.83,46.35 19.39,46.35 R6.1
  Bottom 0.254: U2.12 25.27,45.56 R3.2
N$7
  Bottom 0.203: U2.10 27.86,45.85 R9.2 31.28,44.2 R7.1
N$8
  Bottom 0.203: U2.7 28.06,48.76 28.57,49.28 R2.1 31.28,47.62 R1.2
N$9  (via drill 0.35)
  Top 0.305: v23.11,46.1 23.62,45.59 27.43,45.59 32.51,50.67 v32.51,51.05
  Bottom 0.305: U2.15 23.29,46.1 v23.11,46.1 | v32.51,51.05 C2.2 C8.2
N$10
  Bottom 0.305: D1.A 30.35,30.98 | 30.35,30.98 30.73,30.61 30.99,30.61 | SG1.+ 30.56,30.98 30.35,30.98
  Bottom 0.508: Q1.3 30.48,30.9 SG1.+
N$11  (via drill 0.35)
  Top 0.508: v22.61,54.61 21.97,55.24 20.32,55.24 19.55,54.48 SOL.2
  Bottom 0.203: U2.2 24.26,49.95 24.26,50.55
  Bottom 0.305: L1.P$1 29,53.47 C8.1
  Bottom 0.508: 24.26,50.55 24.26,53.32 L1.P$1 22.96,54.61 v22.61,54.61
N$12
  Bottom 0.203: U2.16 22.81,46.99 22.61,46.99
  Bottom 0.508: 22.81,46.99 21.92,46.1 21.84,46.1 19.91,44.17 L3.P$1
N$13
  Bottom 0.203: R13.1 31.96,26.3 Q1.1
N$14
  Bottom 0.508: U7.8 4.03,22.86 C18.2
N$15
  Bottom 0.203: U2.20 22.88,49.26 22.73,49.4 22.61,49.53
  Bottom 0.508: 22.73,49.4 21.11,51.03 L1.P$2
N$16  (via drill 0.35)
  Top 0.203: v27.18,50.04 26.54,50.04 v25.02,51.56 20.32,51.56 v19.94,51.18
  Bottom 0.203: U2.19 22.49,48.76 22.48,48.77 | U2.6 26.92,49.73 26.92,49.78 v27.18,50.04 | v19.94,51.18 19.94,50.2 C7.1 | U2.3 24.77,51.31 v25.02,51.56
  Bottom 0.457: 22.49,48.76 21.59,48.76 21.34,48.76 20.4,48.76 C6.1
  Bottom 0.508: C6.1 C7.1
N$17
  Bottom 0.203: 34.04,42.93 R12.1
  Bottom 0.305: D2.A 34.16,43.05 34.04,42.93
N$18
  Bottom 0.305: IC2.5 27.08,19.52 R25.2
N$19
  Bottom 0.254: U6.53 20.16,23.88 | 20.16,23.88 20.16,23.74 C11.1 | C14.1 20.59,23.46 20.16,23.88
N$23
  Bottom 0.254: U6.8 11.94,30.86 11.81,30.99 | 11.81,30.99 10.79,32 10.79,32.13 | 10.79,32.13 C16.1 | C3.1 10.76,32.17 10.79,32.13 | L2.2 10.63,30.99 11.81,30.99
RSTLCK
  Bottom 0.203: U6.49 23.48,24.05 U$2.1
RX  (via drill 0.35)
  Top 0.203: v28.19,25.53 28.19,14.73 JP3.6
  Bottom 0.203: U6.44 25.88,29.36 28.19,27.05 v28.19,25.53
SERCOM0_MISO  (via drill 0.35)
  Top 0.203: v16,35.18 15.94,35.12 15.44,35.12 12.7,32.38 1.91,32.38 1.65,32.64 v1.65,32.89
  Bottom 0.203: U1.12 11.36,41.98 15.66,37.67 U6.19 15.66,35.52 v16,35.18 | U5.8 1.78,30.6 1.65,30.73 v1.65,32.89
SERCOM0_MOSI  (via drill 0.35)
  Top 0.203: v3.17,33.02 8.76,38.61 v13.72,38.61
  Bottom 0.203: U1.13 10.35,41.18 13.7,37.83 | U6.17 13.7,37.83 | 3.03,31 U5.7 3.17,31 v3.17,33.02 | v13.72,38.61 13.7,38.59 13.7,37.83
SERCOM0_SCK
  Bottom 0.203: U6.18 15.16,35.74 15.11,35.69 14.48,35.69 9.78,40.39 7.68,40.39 7.08,40.99 | 7.08,40.99 U1.14 | 1.78,36.71 U5.1 1.78,38.99 3.05,40.26 6.35,40.26 7.08,40.99
SERCOM5_MISO
  Bottom 0.203: U6.62 15.66,24 15.41,23.75 12.83,23.75 12.19,23.11 12.19,22.1 12.7,21.59 U7.2
SERCOM5_MOSI
  Bottom 0.203: U6.63 15.16,24.69 14.86,24.38 12.45,24.38 8.89,20.83 8.89,19.68 8.26,19.05 U7.5
SERCOM5_SCK
  Bottom 0.203: U6.64 14.45,25.15 12.06,25.15 7.24,20.32 U7.6
SERCOM7_RX  (via drill 0.35)
  Top 0.203: v16.13,26.54 10.16,20.57 U4.13
  Bottom 0.203: U6.60 16.66,26.13 16.26,26.54 v16.13,26.54
SERCOM7_TX  (via drill 0.35)
  Top 0.203: v14.99,26.67 8.26,19.94 U4.14
  Bottom 0.203: U6.59 17.16,26.65 16.38,27.43 15.75,27.43 v14.99,26.67
SWCLK  (via drill 0.35)
  Top 0.203: v17.78,24 17.78,23.37 30.48,10.67 JP3.4
  Bottom 0.203: U6.57 18.16,24.52 17.78,24.13 v17.78,24
SWDIO  (via drill 0.35)
  Top 0.203: v17.14,22.73 17.78,22.73 30.99,9.53 JP3.2
  Bottom 0.203: U6.58 17.66,24.78 17.02,24.13 17.02,22.86 v17.14,22.73
TX  (via drill 0.35)
  Top 0.203: v27.3,29.21 28.83,27.69 28.83,14.99 30.61,13.21 JP3.8
  Bottom 0.203: U6.43 26.65,29.86 v27.3,29.21
VBUS
  Bottom 0.305: J2.VBUS 31.97,22.13 32.51,21.59 32.51,18.41 31.62,17.53 30.86,17.53 29.59,18.8 29.59,19.81 27.5,21.91 IC2.4 27.08,21.49 25.53,19.94 25.46,20 IC2.1
VCC-ISO  (via drill 0.35)
  Top 0.305: v7.87,34.54 9.27,35.94 13.08,35.94 v16.38,39.24
  Top 0.508: v19.56,38.73 19.56,32.26 v19.05,31.75
  Bottom 0.203: 24.27,45.85 24.26,45.85
  Bottom 0.254: U6.56 18.66,24.52 18.92,24.26 C15.1 17.91,22.44 17.91,20.19 21.11,16.99 U$3.P$1 | U2.14 24.27,45.85
  Bottom 0.305: 16.66,37.47 U6.21 16.66,35.79 | U6.34 23.44,34.37 23.37,34.29 | U6.56 18.66,26.04 18.66,26.54 18.67,26.54 | 23.24,27.3 23.5,27.3 24.11,27.3 U6.48 25.02,26.51 C12.1 | L2.1 7.49,31.66 7.49,34.16 v7.87,34.54 | v16.38,39.24 16.51,39.37 16.91,39.37
  Bottom 0.457: 16.66,37.47 16.66,37.59 16.91,37.84
  Bottom 0.508: 24.27,45.85 22.98,44.57 C19.1 22.35,41.53 20.32,41.53 | 18.66,26.04 18.66,31.62 | 18.66,31.62 18.66,33.79 | 18.66,33.79 16.66,35.79 | 23.44,34.37 19.24,34.37 18.66,33.79 | 23.5,27.3 22.98,27.3 18.66,31.62 | 16.91,37.84 16.91,39.37 L3.P$2 18.44,41.53 20.32,41.53 | 20.32,41.53 19.56,40.77 v19.56,38.73 | v19.05,31.75 18.92,31.62 18.66,31.62
VCC_1  (via drill 0.35)
  Top 0.508: v27.18,40.26 17.78,40.26 | 17.78,40.26 15.62,40.26 v13.97,41.91 | v6.35,38.1 9.91,41.66 v9.91,46.74 | 17.78,40.26 17.78,34.29 15.56,32.07 | 15.56,32.07 14.61,31.11 v6.99,31.11 | 15.56,32.07 15.56,28.77 17.4,26.92 17.4,25.4 16.13,24.13 16.13,20.19 v16.26,20.07 | v4.95,12.19 4.82,12.06 U4.17 | U4.2 8.26,2.03 v9.14,1.14 10.16,2.16 U4.3
  Bottom 0.508: SG1.- 26.21,39.33 C1.1 | C1.1 D1.C | U3.5 12.26,44.04 C4.1 | C4.1 11.9,44.4 R8.2 10.79,47.62 10.16,48.26 C22.1 | U1.1 4.54,41.18 3.81,41.91 3.81,42.55 | 3.81,42.55 3.81,44.45 4.54,45.18 U1.6 5.85,46.83 C10.1 6.13,48.05 6.35,48.26 C22.1 | 3.81,42.55 2.5,42.55 C17.+ | R4.2 5.81,39.44 C13.1 6.35,38.9 v6.35,38.1 | C1.1 26.67,39.75 v27.18,40.26 | v13.97,41.91 12.48,43.4 C4.1 | v9.91,46.74 9.91,48.14 C22.1 | v6.99,31.11 6.72,30.85 U5.5 5.58,28.86 C9.1 6.48,27.65 6.48,25.27 8.38,23.37 8.38,22.61 7.37,21.59 U7.7 6.36,21.38 C18.1 4.45,20.74 4.45,15.88 5.71,14.61 5.71,12.95 v4.95,12.19 4.95,0.76 5.08,0.64 8.64,0.64 v9.14,1.14 | U7.3 14.61,20.32 15.75,21.46 R11.2 16.26,21.01 v16.26,20.07 19.56,16.76 19.56,11.43 23.24,7.75 31.75,7.75 32.26,8.26 JP3.1
VIN  (via drill 0.35)
  Top 0.457: v15.24,49.53 15.22,49.51 BAT.2 19.68,48.76 | 19.68,48.76 20.07,48.76 v21.34,47.5 | v23.75,25.4 23.75,32.64 28.57,37.47 28.57,40.77 27.43,41.91 23.11,41.91 19.68,45.34 19.68,48.76
  Top 0.508: BAT.2 14.83,49.15 v13.72,49.15
  Bottom 0.305: U2.18 22.74,48.26 22.71,48.23 22.07,48.23 21.96,48.12
  Bottom 0.457: 12.26,47.43 U3.1 | C5.1 14.16,50.06 14.16,49.53 v15.24,49.53 | 21.96,48.12 v21.34,47.5 | IC2.3 24.13,22.26 24.13,25.02 v23.75,25.4
  Bottom 0.508: U3.1 12.26,48.45 13.06,49.26 13.08,49.26 | 14.16,50.06 13.88,50.06 13.6,49.78 | 13.08,49.26 13.6,49.78 | v13.72,49.15 13.19,49.15 13.08,49.26 | v13.72,49.15 14.1,49.53 14.16,49.53 | v13.72,49.15 13.72,49.66 13.6,49.78

### Text on the board
tNames: ParaBeep V0.2!